# EAGLE design StormBox (EAGLE 5.11)
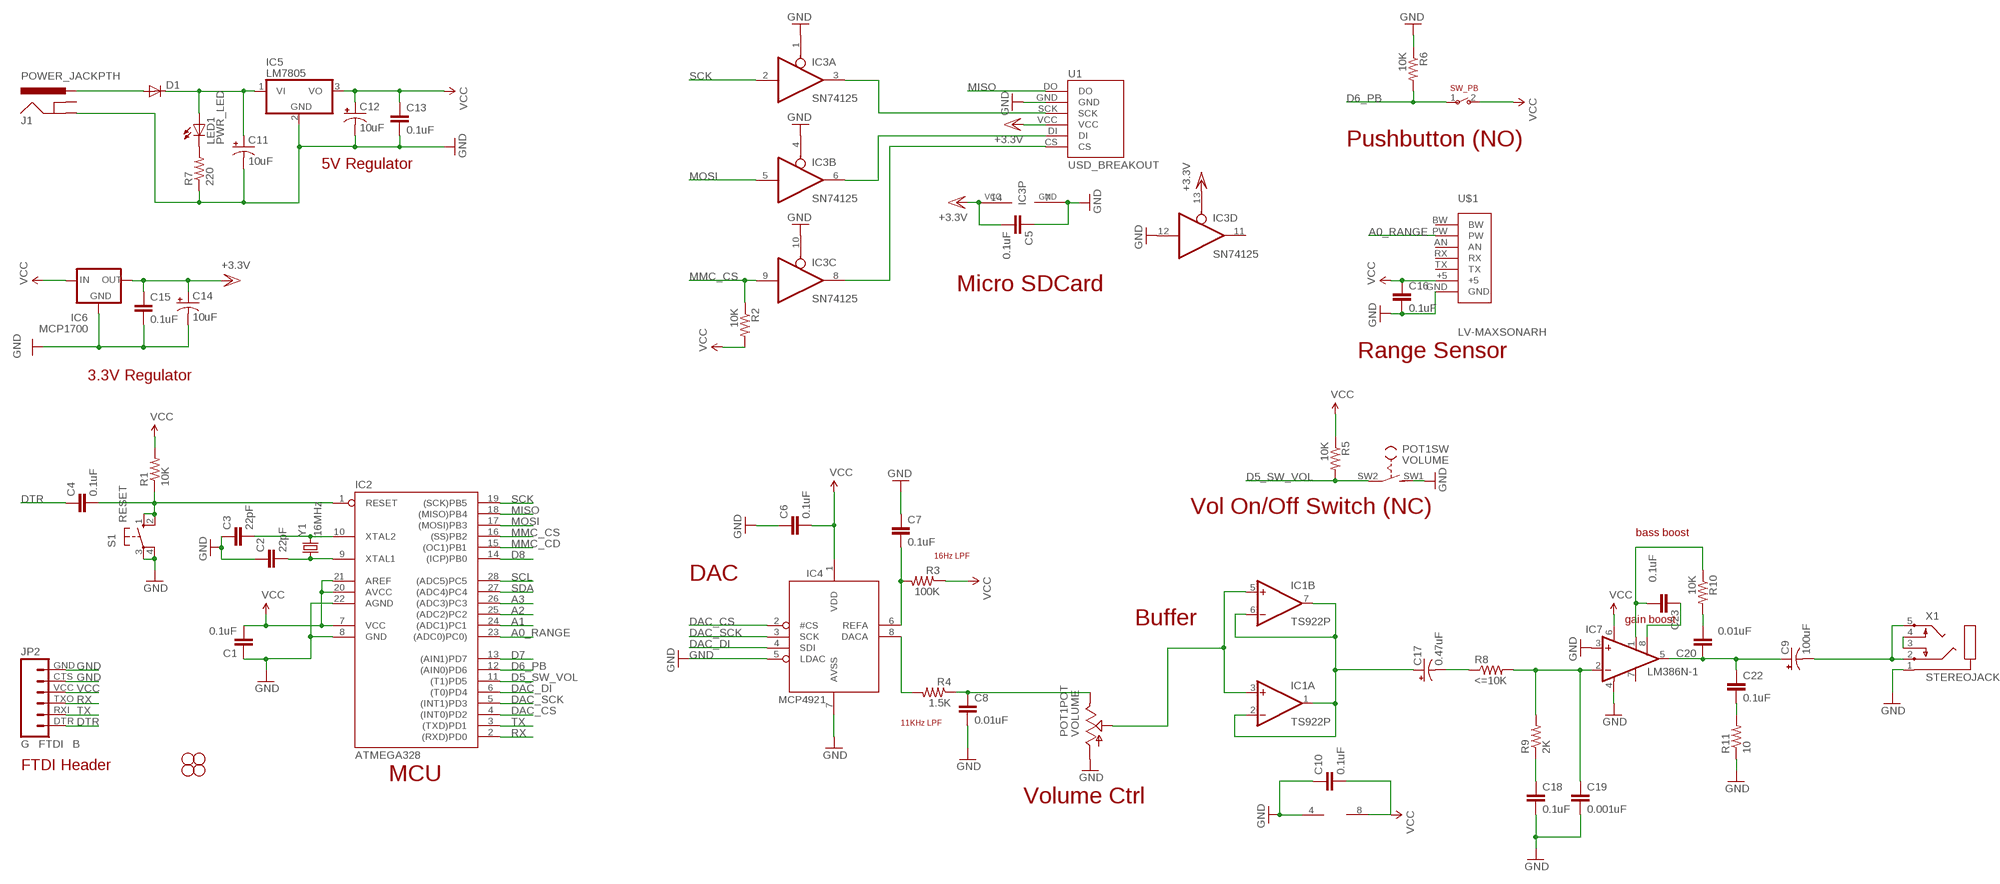
[diagram p0: schematic, sheet 1]

## Parts
C1  0.1uF  CAPPTH  [CAP-PTH-SMALL]
C2  22pF  CAPPTH  [CAP-PTH-SMALL]
C3  22pF  CAPPTH  [CAP-PTH-SMALL]
C4  0.1uF  CAPPTH  [CAP-PTH-SMALL]
C5  0.1uF  CAPPTH  [CAP-PTH-SMALL]
C6  0.1uF  CAPPTH  [CAP-PTH-SMALL]
C7  0.1uF  CAPPTH  [CAP-PTH-SMALL]
C8  0.01uF  CAPPTH  [CAP-PTH-SMALL]
C9  100uF  CAP_POLPTH1  [CPOL-RADIAL-100UF-25V]
C10  0.1uF  CAPPTH  [CAP-PTH-SMALL]
C11  10uF  CAP_POLPTH2  [CPOL-RADIAL-10UF-25V]
C12  10uF  CAP_POLPTH2  [CPOL-RADIAL-10UF-25V]
C13  0.1uF  CAPPTH  [CAP-PTH-SMALL]
C14  10uF  CAP_POLPTH2  [CPOL-RADIAL-10UF-25V]
C15  0.1uF  CAPPTH  [CAP-PTH-SMALL]
C16  0.1uF  CAPPTH  [CAP-PTH-SMALL]
C17  0.47uF  CAP_POLPTH2  [CPOL-RADIAL-10UF-25V]
C18  0.1uF  CAPPTH  [CAP-PTH-SMALL]
C19  0.001uF  CAPPTH  [CAP-PTH-SMALL]
C20  0.01uF  CAPPTH  [CAP-PTH-SMALL]
C22  0.1uF  CAPPTH  [CAP-PTH-SMALL]
C23  0.1uF  CAPPTH  [CAP-PTH-SMALL]
D1  DIODE1N4148  [DIODE-1N4148]
IC1  TS922P  [DIL08]
IC2  ATMEGA328  AT90S4433P  [DIL28-3]
IC3  SN74125  74125N  [DIL14]
IC4  MCP4921  [DIL08]
IC5  LM7805  7805T  [TO220H]
IC6  MCP1700  MCP1700INLINE  [TO92-INLINE]
IC7  LM386N-1  [DIL08]
J1  POWER_JACKPTH  [POWER_JACK_PTH]
JP1  STAND-OFF  [STAND-OFF]
JP2  G FTDI B  FTDI_BASICPTH  [FTDI_BASIC]
JP3  STAND-OFF  [STAND-OFF]
JP4  STAND-OFF  [STAND-OFF]
JP5  STAND-OFF  [STAND-OFF]
LED1  PWR_LED  LED3MM  [LED3MM]
POT1  VOLUME  THUMBPOT  [THUMBWHEEL]
R1  10K  RESISTORPTH-1/4W  [AXIAL-0.4]
R2  10K  RESISTORPTH-1/4W  [AXIAL-0.4]
R3  100K  RESISTORPTH-1/4W  [AXIAL-0.4]
R4  1.5K  RESISTORPTH-1/4W  [AXIAL-0.4]
R5  10K  RESISTORPTH-1/4W  [AXIAL-0.4]
R6  10K  RESISTORPTH-1/4W  [AXIAL-0.4]
R7  220  RESISTORPTH-1/4W  [AXIAL-0.4]
R8  <=10K  RESISTORAXIAL-0.3  [AXIAL-0.3]
R9  2K  RESISTORAXIAL-0.3  [AXIAL-0.3]
R10  10K  RESISTORAXIAL-0.3  [AXIAL-0.3]
R11  10  RESISTORAXIAL-0.3  [AXIAL-0.3]
S1  RESET  10-XX  [B3F-10XX]
SW_PB  BUTTON  SWITCH-SPSTPTH  [1X02_LOCK_LONGPADS]
U1  USD_BREAKOUT  USD_BREAKOUTNOCD  [USD_BREAKOUT]
U$1  LV-MAXSONARH  [LV-MAXSONAR]
X1  STEREOJACK  [STX3100]
Y1  16MHz  CRYSTALHC49US  [HC49US]

## Nets
A0_RANGE: IC2.23((ADC0)PC0)) U$1.PW
A1: IC2.24((ADC1)PC1)
A2: IC2.25((ADC2)PC2)
A3: IC2.26((ADC3)PC3)
D5_SW_VOL: IC2.11((T1)PD5) POT1.SW2(SW:P) R5.P$2
D6_PB: IC2.12((AIN0)PD6) R6.P$2 SW_PB.1
D7: IC2.13((AIN1)PD7)
D8: IC2.14((ICP)PB0)
DAC_CS: IC2.4((INT0)PD2) IC4.2(#CS)
DAC_DI: IC2.6((T0)PD4) IC4.4(SDI)
DAC_SCK: IC2.5((INT1)PD3) IC4.3(SCK)
DTR: C4.1 JP2.DTR
GND [power]: C1.1 C2.1 C3.1 C5.1 C6.1 C7.1 C8.2 C10.1 C11.2(-) C12.2(-) C13.2 C14.2(-) C15.2 C16.2 C18.2 C19.2 IC1.4(P:V-) IC2.8(GND) IC2.22(AGND) IC3.1(A:OE) IC3.4(B:OE) IC3.7(P:GND) IC3.10(C:OE) IC3.12(D:I) IC4.5(LDAC) IC4.7(AVSS) IC5.2(GND) IC6.1(GND) IC7.3(+IN) IC7.4(GND) J1.GND JP2.CTS JP2.GND POT1.1(POT:A) POT1.SW1(SW:S) R6.P$1 R7.P$1 R11.P$1 S1.3(P) S1.4(P1) U1.GND U$1.GND X1.1
LINE_A: IC1.3(A:+IN) IC1.5(B:+IN) POT1.2(POT:S)
MISO: IC2.18((MISO)PB4) U1.DO
MMC_CD: IC2.15((OC1)PB1)
MMC_CS: IC2.16((SS)PB2) IC3.9(C:I) R2.P$1
MOSI: IC2.17((MOSI)PB3) IC3.5(B:I)
N$1: IC3.8(C:O) U1.CS
N$2: IC3.6(B:O) U1.DI
N$3: C4.2 IC2.1(RESET) R1.P$1 S1.1(S) S1.2(S1)
N$4: C17.2(-) R8.P$1
N$5: IC3.3(A:O) U1.SCK
N$6: C8.1 POT1.3(POT:E) R4.P$1
N$7: IC4.8(DACA) R4.P$2
N$8: C17.1(+) IC1.1(A:OUT) IC1.2(A:-IN) IC1.6(B:-IN) IC1.7(B:OUT)
N$9 [power]: C11.1(+) D1.C IC5.1(VI) LED1.A
N$10: LED1.K(C) R7.P$2
N$11 [power]: D1.A J1.PWR
N$12: X1.3 X1.4
N$13: C9.2(-) X1.2 X1.5
N$14: C19.1 IC7.2(-IN) R8.P$2 R9.P$2
N$15: C18.1 R9.P$1
N$16: C23.1 IC7.8(GAIN)
N$17: C9.1(+) C20.1 C22.1 IC7.5(OUT)
N$18: C20.2 R10.P$2
N$19: C7.2 IC4.6(REFA) R3.P$2
N$20: C23.2 IC7.1(GAIN) R10.P$1
N$21: C22.2 R11.P$2
RX: IC2.2((RXD)PD0) JP2.TXO
SCK: IC2.19((SCK)PB5) IC3.2(A:I)
SCL: IC2.28((ADC5)PC5)
SDA: IC2.27((ADC4)PC4)
TX: IC2.3((TXD)PD1) JP2.RXI
VCC [power]: C1.2 C6.2 C10.2 C12.1(+) C13.1 C16.1 IC1.8(P:V+) IC2.7(VCC) IC2.20(AVCC) IC2.21(AREF) IC4.1(VDD) IC5.3(VO) IC6.2(IN) IC7.6(VS) JP2.VCC R1.P$2 R2.P$2 R3.P$1 R5.P$1 SW_PB.2 U$1.+5
VCC/2 [power]: C5.2 C14.1(+) C15.1 IC3.13(D:OE) IC3.14(P:VCC) IC6.3(OUT) U1.VCC ; supply symbol labelled +3.3V
XTAL1: C2.2 IC2.9(XTAL1) Y1.1
XTAL2: C3.2 IC2.10(XTAL2) Y1.2
Unconnected: IC3.11(D:O) IC7.7(BYPASS) J1.GNDBREAK U$1.AN U$1.BW U$1.RX U$1.TX

## Notes on the sheet
- Pushbutton (NO)
- 5V Regulator
- Micro SDCard
- Range Sensor
- 3.3V Regulator
- Vol On/Off Switch (NC)
- bass boost
- 16Hz LPF
- DAC
- Buffer | gain boost
- 11KHz LPF
- FTDI Header
- MCU
- Volume Ctrl

## Library data of the parts
C1-C8 C10 C13 C15 C16 C18-C20 C22 C23 = SparkFun:CAP: Capacitor Standard 0603 ceramic capacitor, and 0.1" leaded capacitor.
C9 C11 C12 C14 C17 = SparkFun:CAP_POL: Capacitor Polarized These are standard SMD and PTH capacitors. Normally 10uF, 47uF, and 100uF in electrolytic and tantalum varieties. Always verify the external diameter of the through hole cap, it varies with capacity, voltage, and manufacturer. The EIA devices should be standard.
D1 = SparkFun:DIODE: Diode These are standard reverse protection diodes and small signal diodes. SMA package can handle up to about 1A. SOD-323 can handle about 200mA. What the SOD-323 package when ordering, there are some mfgs out there that are 5-pin packages.
IC1 = Dek:TS922: OP AMP
IC2 = atmel:AT90S4433: MICROCONTROLLER 4 Kbytes FLASH 128 bytes SRAM 256 bytes EEPROM UART 6-channel 10 bit ADC; OC_FARNELL: unknown; OC_NEWARK: unknown
IC3 = adafruit:74*125: Quad bus BUFFER, 3-state
IC4 = adafruit:MCP4921
IC5 = linear:78*: Positive VOLTAGE REGULATOR Source: http://cache.national.com/ds/LM/LM78L05.pdf http://www.fairchildsemi.com/ds/LM/LM7805.pdf
IC6 = adafruit:MCP1700: VOLTAGE REGULATOR
IC7 = Dek:LM386?-*: Low Voltage Audio Power Amplifier Source: http://cache.national.com/ds/LM/LM386.pdf
J1 = SparkFun:POWER_JACK: Power Jack This is the standard 5.5mm barrel jack for power. The PTH is the most common, proven, reliable, footprint. All others are experimental. The Slot footprint only works if the mill layer is transmitted to the PCB fab house so be warned. Spark Fun Electronics SKU : PRT-00119. Mating wall wart : TOL-00298 (and others)
JP1 JP3-JP5 = SparkFun:STAND-OFF: Stand Off This is the mechanical footprint for a #4 phillips button head screw. Use the keepout ring to avoid running the screw head into surrounding components. SKU : PRT-00447
JP2 = SparkFun:FTDI_BASIC: FTDI Basic: 3.3V and 5V
LED1 = SparkFun:LED: LEDs Standard schematic elements and footprints for 5mm, 3mm, 1206, and 0603 sized LEDs. 5mm - Spark Fun Electronics SKU : COM-00529 (and others)
POT1 = adafruit:THUMBPOT: Thumbwheel pot with switch Available in horizontal (Alpha RV121SF) or vertical (Xicon 311-1701)
R1-R11 = SparkFun:RESISTOR: Resistor Basic schematic elements and footprints for 0603, 1206, and PTH resistors.
S1 = switch-omron:10-XX: OMRON SWITCH; MPN: B3F-1000; OC_FARNELL: 176432; OC_NEWARK: 36M3542
SW_PB = Dek:SWITCH-SPST
U1 = Dek:USD_BREAKOUT
U$1 = Dek:LV-MAXSONAR
X1 = adafruit:STEREOJACK: MIC/HEADPHONE JACK Stereo jack with two switches. Kycon STX3100, CUI SJ1-3555NG and/or 4UCon 05544
Y1 = SparkFun:CRYSTAL: Crystals Various standard crystals. Proven footprints. Spark Fun Electronics SKU : COM-00534

## Board
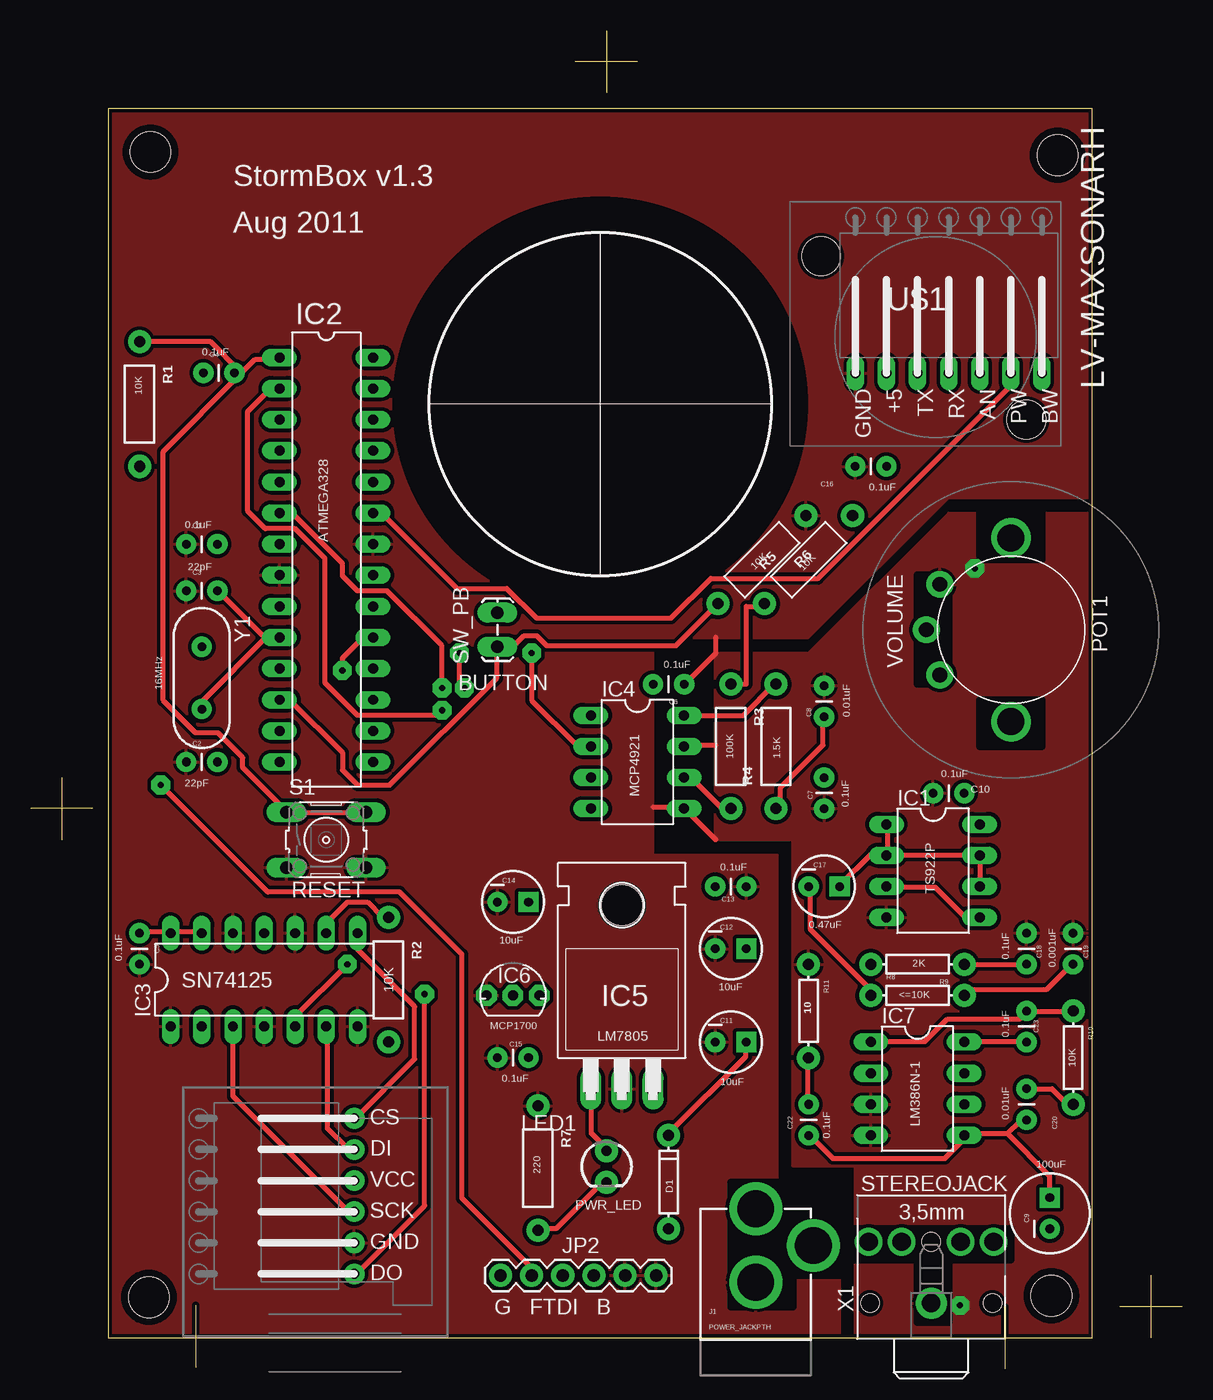
[diagram p1: board, top side]
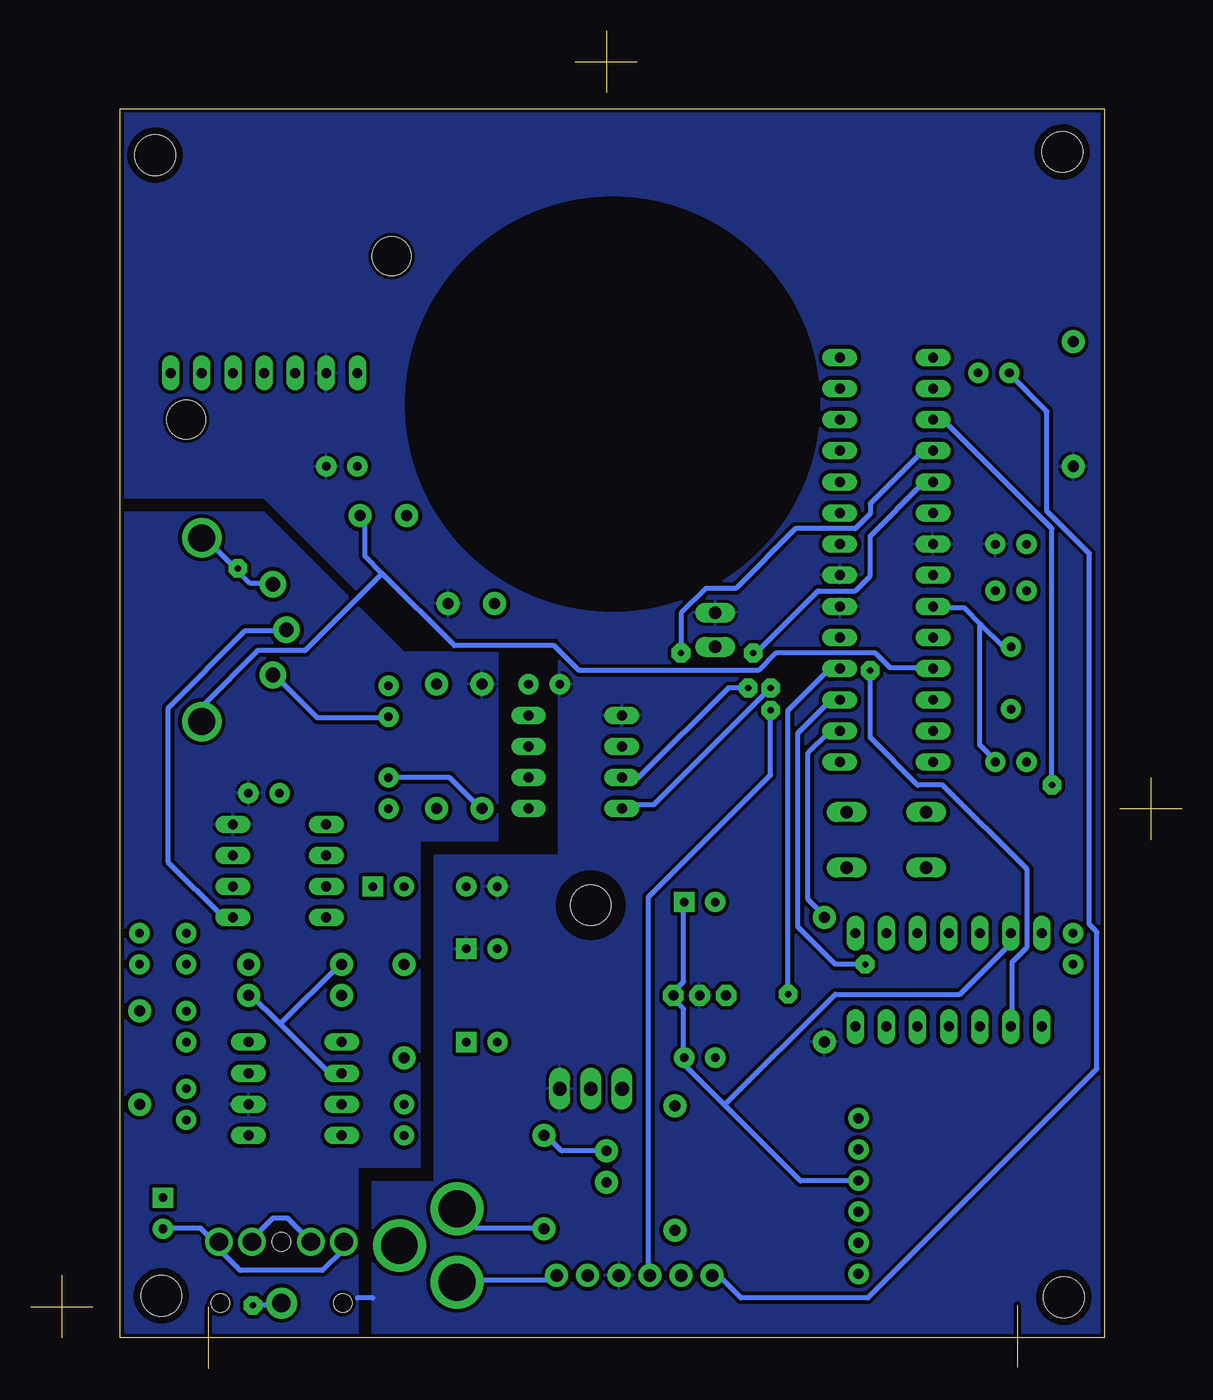
[diagram p2: board, bottom side, seen from below]

Size 93.98 x 109.22 mm. Coordinates in mm from the lower left corner, seen from the top.
Outline: 13.46,5.21 13.46,0.13
Outline: 79.5,5.08 79.5,0
Outline: 49.53,106.68 44.45,106.68
Outline: 46.99,109.22 46.99,104.14
Outline: 5.08,45.72 0,45.72
Outline: 2.54,48.26 2.54,43.18
Outline: 93.98,5.08 88.9,5.08
Outline: 91.44,7.62 91.44,2.54
Outline: 6.35,2.54 86.66,2.54 86.66,102.86 6.35,102.86 6.35,2.54
Copper layers (1*16): Top 0.035mm / dielectric 1.5mm / Bottom 0.035mm
Design rules "Dek": minimum track width 16mil, minimum drill 20mil, track to track 12mil, track to pad 12mil, pad to pad 12mil, via to via 12mil, smd to smd 0mil, copper to edge 10mil, drill to drill 12mil, minimum pad ring 12mil, minimum via ring 20mil, stop-mask expansion 4mil, vias tented up to drill 25mil, thermal gap 10mil
tRestrict: area 30,62.2 to 63,95.3; area 77.5,66 to 82.5,69.9; area 72.4,55.9 to 74.9,64.8; area 77.5,50.8 to 82.5,54.6; area 67.3,8.9 to 80,11.4; area 72.4,3.8 to 74.9,11.4; area 57.1,7.6 to 66,12.7; area 57.1,5.1 to 62.2,15.2
bRestrict: area 30,62.2 to 63,95.3

### Footprints (pad centres in the part's own frame; a part is rotated, then mirrored left to right if it is on the bottom)
CAP-PTH-SMALL = drill 0.7 pad 1.651 round: 1 0,0; 2 2.54,0
CPOL-RADIAL-100UF-25V = drill 0.7 pad 1.651 square: 1 1.27,0 | drill 0.7 pad 1.651 round: 2 -1.27,0
CPOL-RADIAL-10UF-25V = drill 0.7 pad 1.651 square: 1 1.27,0 | drill 0.7 pad 1.651 round: 2 -1.27,0
DIODE-1N4148 = drill 0.9 pad 1.88 round: A -3.81,0; C 3.81,0
DIL08 = drill 0.813 pad 1.27 long: 1 -3.81,-3.81; 2 -1.27,-3.81; 3 1.27,-3.81; 4 3.81,-3.81; 5 3.81,3.81; 6 1.27,3.81; 7 -1.27,3.81; 8 -3.81,3.81
DIL28-3 = drill 0.813 long: 1 -16.51,-3.81; 2 -13.97,-3.81; 3 -11.43,-3.81; 4 -8.89,-3.81; 5 -6.35,-3.81; 6 -3.81,-3.81; 7 -1.27,-3.81; 8 1.27,-3.81; 9 3.81,-3.81; 10 6.35,-3.81; 11 8.89,-3.81; 12 11.43,-3.81; 13 13.97,-3.81; 14 16.51,-3.81; 15 16.51,3.81; 16 13.97,3.81; 17 11.43,3.81; 18 8.89,3.81; 19 6.35,3.81; 20 3.81,3.81; 21 1.27,3.81; 22 -1.27,3.81; 23 -3.81,3.81; 24 -6.35,3.81; 25 -8.89,3.81; 26 -11.43,3.81; 27 -13.97,3.81; 28 -16.51,3.81
DIL14 = drill 0.813 long: 1 -7.62,-3.81; 2 -5.08,-3.81; 3 -2.54,-3.81; 4 0,-3.81; 5 2.54,-3.81; 6 5.08,-3.81; 7 7.62,-3.81; 8 7.62,3.81; 9 5.08,3.81; 10 2.54,3.81; 11 0,3.81; 12 -2.54,3.81; 13 -5.08,3.81; 14 -7.62,3.81
DIL08' = drill 0.813 long: 1 -3.81,-3.81; 2 -1.27,-3.81; 3 1.27,-3.81; 4 3.81,-3.81; 5 3.81,3.81; 6 1.27,3.81; 7 -1.27,3.81; 8 -3.81,3.81
TO220H = drill 1.118 long: 1 -2.54,-10.16; 2 0,-10.16; 3 2.54,-10.16 | hole 3.302: 0,4.826
TO92-INLINE = drill 0.813 pad 1.676 octagon: 1 -2.159,0; 2 0,0; 3 2.159,0
POWER_JACK_PTH = drill 2.997 pad 4.318 round: GND 0,7.7; GNDBREAK 4.7,10.7; PWR 0,13.7
STAND-OFF = hole 3.302: 0,0
FTDI_BASIC = drill 1.016 pad 1.88 round: CTS 10.16,0; DTR 0,0; GND 12.7,0; RXI 2.54,0; TXO 5.08,0; VCC 7.62,0
LED3MM = drill 0.813 pad 1.88 round: A -1.27,0; K 1.27,0
THUMBWHEEL = drill 1.2 pad 2.184 round: 1 -3.7,-5.8; 2 0,-6.9; 3 3.7,-5.8 | drill 2.2 round: SW1 -7.5,0; SW2 7.5,0
AXIAL-0.4 = drill 0.9 pad 1.88 round: P$1 -5.08,0; P$2 5.08,0
AXIAL-0.3 = drill 0.9 pad 1.88 round: P$1 -3.81,0; P$2 3.81,0
B3F-10XX = drill 1.016 long: 1 -3.251,2.261; 2 3.251,2.261; 3 -3.251,-2.261; 4 3.251,-2.261
1X02_LOCK_LONGPADS = drill 1.016 long: 1 -0.127,0; 2 2.667,0
USD_BREAKOUT = drill 0.8 pad 1.676 round: CS 7.62,2.54; DI 7.62,5.08; DO 7.62,15.24; GND 7.62,12.7; SCK 7.62,10.16; VCC 7.62,7.62
LV-MAXSONAR = drill 0.8 long: +5 -13.97,13.97; AN -13.97,6.35; BW -13.97,1.27; GND -13.97,16.51; PW -13.97,3.81; RX -13.97,8.89; TX -13.97,11.43 | hole 3.15: -17.78,2.54; -4.445,19.304
STX3100 = drill 1.5 pad 2.54 round: 1 2.7,-0.1 | drill 1.5 round: 2 7.7,5; 3 7.7,2.3; 4 7.7,-2.5; 5 7.7,-5.2 | hole 1.5: 2.7,4.9; 2.7,-5.1; 7.7,-0.1
HC49US = drill 0.7 pad 1.651 round: 1 -2.54,0; 2 2.54,0

### Placement (x,y rotation side)
C1  12.7,67.31 0 top
C2  12.7,49.53 0 top
C3  12.7,63.5 0 top
C4  14.1,81.28 0 top
C5  8.89,33.02 90 top
C6  53.34,55.88 180 top
C7  64.77,45.72 90 top
C8  64.77,53.21 90 top
C9  83.18,12.7 90 top
C10  73.66,46.99 0 top
C11  57.15,26.67 0 top
C12  57.15,34.29 0 top
C13  55.88,39.37 0 top
C14  39.37,38.1 0 top
C15  40.64,25.4 180 top
C16  69.85,73.66 180 top
C17  64.77,39.37 0 top
C18  81.28,33.02 90 top
C19  85.09,33.02 90 top
C20  81.28,20.32 90 top
C22  63.5,19.05 90 top
C23  81.28,26.67 90 top
D1  52.07,15.24 90 top
IC1  73.66,40.64 270 top
IC2  24.13,66.04 270 top
IC3  19.05,31.75 0 top
IC4  MCP4921  [DIL08']  49.53,49.53 270 top
IC5  48.26,33.02 0 top
IC6  39.37,30.48 0 top
IC7  72.39,22.86 270 top
J1  59.18,-0.63 0 top
JP1  9.65,5.84 0 top
JP2  38.35,7.62 0 top
JP3  9.78,99.31 0 top
JP4  83.31,5.97 0 top
JP5  83.82,99.06 0 top
LED1  46.99,16.51 270 top
POT1  80.01,60.32 270 top
R1  8.89,78.74 270 top
R2  29.21,31.75 270 top
R3  57.15,50.8 270 top
R4  60.83,50.8 90 top
R5  63.5,66.04 45 top
R6  59.69,66.04 225 top
R7  41.4,16.38 270 top
R8  72.39,30.48 0 top
R9  72.39,33.02 180 top
R10  85.09,25.4 270 top
R11  63.5,29.21 270 top
S1  24.13,43.18 0 top
SW_PB  38.1,59.05 90 top
U1  34.04,22.99 180 top
U$1  83.82,95.25 90 top
X1  73.41,2.67 90 top
Y1  13.97,56.39 270 top

### Tracks (layer width: path | path; a pad name or v marks a point on that pad's centre or on a via)
A0_RANGE
  Top 0.406: U$1.PW 79.91,81.18 79.91,80.16 64.26,64.52 55.52,64.52 52.27,61.27 41.3,61.27 38.86,63.7 34.8,63.7 28.7,69.8 28.09,69.8 IC2.23
D5_SW_VOL
  Bottom 0.406: 65.28,64.92 66.7,66.34 66.7,69.39 66.9,69.6 R5.P$2 | 65.28,64.92 59.38,59.03 51.26,59.03 49.23,57 34.59,57 33.17,58.42 25.04,58.42 23.83,57.2 20.37,57.2 IC2.11 | 65.28,64.92 71.58,58.62 75.44,58.62 79.91,54.15 79.91,52.93 POT1.SW2
D6_PB
  Top 0.406: IC2.12 20.37,54.56 21.18,54.56 25.45,50.29 25.45,48.87 26.67,47.65 29.31,47.65 38.05,56.39 38.05,58.83 SW_PB.1 38.25,59.03 39.47,59.03 40.28,59.84 41.3,59.84 42.11,59.03 52.68,59.03 R6.P$2
DAC_CS  (via drill 0.51)
  Top 0.406: v40.89,58.42 40.89,54.56 44.55,50.9 45.57,50.9 IC4.2
  Bottom 0.406: v40.89,58.42 40.89,61.67 38.86,63.7 36.42,63.7 31.55,68.58 26.67,68.58 25.45,69.8 25.45,70.61 21.18,74.88 20.37,74.88 IC2.4
DAC_DI  (via drill 0.51)
  Top 0.406: v33.58,55.57 33.58,59.03 29.11,63.5 26.67,63.5 25.45,64.72 25.45,65.73 21.39,69.8 20.37,69.8 IC2.6
  Bottom 0.406: v33.58,55.57 43.13,46.02 45.36,46.02 45.57,45.82 IC4.4
DAC_SCK  (via drill 0.51)
  Top 0.406: v35,58.42 35,55.98 v35.41,55.57
  Bottom 0.406: v35,58.42 34.8,58.42 29.72,63.5 26.67,63.5 25.45,64.72 25.45,67.97 21.18,72.24 20.37,72.24 IC2.5 | v35.41,55.57 37.03,55.57 44.35,48.26 IC4.3
DTR
  Bottom 0.406: C4.1 14.07,81.18 11.02,78.13 11.02,70 7.57,66.55 7.57,36.27 6.96,35.66 6.96,24.49 25.65,5.79 36.02,5.79 37.85,7.62 JP2.DTR
GND  (via drill 0.51)
  Top 0.406: 50.8,45.82 53.29,45.82 IC4.5 53.49,45.62 55.93,43.18 | 55.93,50.9 53.49,50.9 IC4.7 | 55.93,58.42 53.49,55.98 C6.1 | 55.93,58.42 55.88,58.42 | 55.93,58.42 55.93,59.69
  Bottom 0.406: 77.16,65.23 79.91,67.97 POT1.SW1 | 77.16,65.23 76.05,64.11 74.22,64.11 POT1.1 | v75.84,5.18 73.61,5.18 X1.1 | 77.16,65.23 v77.06,65.33 | JP2.GND 51.46,7.21 59.18,7.21 J1.GND
  pour Top (isolate 0.305): 67.31,1.27 67.31,16.51 62.23,16.51 62.23,43.18 55.88,43.18 55.88,58.42 63.5,58.42 74.93,69.85 88.9,69.85 88.9,1.27
  pour Top (isolate 0.305): 66.04,1.27 66.04,15.24 60.96,15.24 60.96,41.91 50.8,41.91 50.8,59.69 63.5,59.69 74.93,71.12 88.9,71.12 88.9,104.14 5.08,104.14 5.08,1.27
LINE_A
  Top 0.406: IC1.3 69.95,39.32 73.81,39.32 76.25,36.88 77.47,36.88 IC1.5
  Bottom 0.406: POT1.2 73.2,60.25 76.45,60.25 82.75,53.95 82.75,41.35 78.28,36.88 77.47,36.88 IC1.5
MISO  (via drill 0.51)
  Top 0.406: v32.16,30.58 32.16,13.31 26.47,7.62 U1.DO
  Bottom 0.406: v32.16,30.58 32.16,53.75 28.91,57 28.09,57 IC2.18
MMC_CS
  Top 0.406: IC3.9 24.23,35.66 24.23,36.47 25.86,38.1 27.48,38.1 28.7,36.88 29.11,36.88 R2.P$1
  Bottom 0.406: IC2.16 28.09,51.92 28.91,51.92 30.53,50.29 30.53,38.3 29.11,36.88 R2.P$1
MOSI  (via drill 0.51)
  Top 0.406: IC3.5 21.59,28.75 v25.86,33.02
  Bottom 0.406: v25.86,33.02 28.3,33.02 31.34,36.07 31.34,51.92 28.7,54.56 28.09,54.56 IC2.17
N$1
  Top 0.406: IC3.8 26.67,34.24 31.34,29.57 31.34,25.3 26.47,20.42 U1.CS
N$2
  Top 0.406: IC3.6 24.23,27.94 24.23,19.61 25.86,17.98 26.26,17.98 U1.DI
N$3
  Top 0.406: S1.2 27.28,45.41 20.98,45.41 S1.1 20.78,45.62 17.32,49.07 17.32,49.89 15.29,51.92 13.46,51.92 10.82,54.56 10.82,74.88 17.12,81.18 C4.2 | 17.12,81.38 16.71,81.38 C4.2 | 17.12,81.38 17.32,81.38 18.34,82.4 20.17,82.4 IC2.1 | 17.12,81.38 14.68,83.82 R1.P$1 | C4.2 17.12,81.38
N$4
  Top 0.406: C17.2 63.65,39.32 63.65,35.87 68.53,30.99 68.53,30.58 R8.P$1
N$5
  Top 0.406: IC3.3 16.51,22.25 25.86,12.9 26.26,12.9 U1.SCK
N$6
  Top 0.406: C8.1 64.67,53.14 64.67,50.9 61.21,47.45 61.21,46.02 61.01,45.82 R4.P$1
  Bottom 0.406: POT1.3 74.02,56.59 70.56,53.14 64.87,53.14 C8.1
N$7
  Top 0.406: IC4.8 58.17,53.34 60.81,55.98 R4.P$2
N$8
  Top 0.406: IC1.6 IC1.7 77.47,41.96 70.16,41.96 IC1.2 | IC1.2 69.95,41.96 69.95,44.4 IC1.1 | C17.1 66.09,39.52 68.53,41.96 69.75,41.96 IC1.2
N$9
  Top 0.406: LED1.A 46.99,17.98 45.77,19.2 45.77,22.86 IC5.1 | C11.1 58.37,26.52 58.37,25.5 52.07,19.2 D1.C
  Bottom 0.406: LED1.A 50.65,17.78 52.07,19.2 D1.C
N$10
  Top 0.406: R7.P$2 41.5,11.48 42.93,11.48 46.58,15.14 46.99,15.14 LED1.K
N$11
  Bottom 0.406: D1.A 52.07,11.48 57.56,11.48 59.18,13.11 J1.PWR
N$12
  Bottom 0.406: X1.3 71.17,10.46 73,12.29 74.22,12.29 76.05,10.46 X1.4
N$13
  Bottom 0.406: C9.2 83.16,11.48 80.11,11.48 79.1,10.46 78.69,10.46 X1.5 79.3,10.46 76.86,8.03 70.16,8.03 68.53,9.65 68.53,10.26 X1.2
N$14
  Top 0.406: C19.1 84.99,33.02 82.96,30.99 76.66,30.99 76.25,30.58 R8.P$2
  Bottom 0.406: 73.61,28.14 76.05,30.58 R8.P$2 | 73.61,28.14 69.75,24.28 68.73,24.28 IC7.2 | 73.61,28.14 68.73,33.02 R9.P$2
N$15
  Top 0.406: R9.P$1 C18.1
N$16
  Top 0.406: IC7.8 76.25,26.72 81.13,26.72 C23.1
N$17
  Top 0.406: 76.66,19.2 79.7,19.2 | 76.66,19.2 76.25,19.2 IC7.5 76.66,19.2 | 79.7,19.2 80.72,20.22 81.13,20.22 C20.1 | 76.66,19.2 74.62,17.17 65.48,17.17 63.65,19 C22.1 | 79.7,19.2 83.16,15.75 83.16,14.12 C9.1
N$18
  Top 0.406: C20.2 83.36,22.86 84.58,21.64 84.99,21.64 R10.P$2
N$19
  Top 0.406: IC4.6 53.9,48.26 56.34,45.82 57.15,45.82 R3.P$2
  Bottom 0.406: C7.2 59.79,48.26 57.15,45.62 R3.P$2
N$20
  Top 0.406: 81.33,29.16 80.72,28.55 74.83,28.55 73,26.72 68.73,26.72 IC7.1 | 81.33,29.16 84.99,29.16 R10.P$1 | 81.33,29.16 C23.2
N$21
  Top 0.406: C22.2 63.45,21.64 63.45,25.3 R11.P$2
RX  (via drill 0.51)
  Top 0.406: v33.58,53.75 33.17,53.34 26.67,53.34 24.03,55.98 24.03,66.14 21.59,68.58 19.15,68.58 17.73,70 17.73,78.13 19.56,79.96 20.17,79.96 IC2.2
  Bottom 0.406: v33.58,53.75 33.58,48.46 43.54,38.51 43.54,7.62 JP2.TXO
SCK  (via drill 0.51)
  Top 0.406: v25.45,57 25.45,58.01 27.08,59.64 27.89,59.64 IC2.19
  Bottom 0.406: v25.45,57 25.45,51.51 21.59,47.65 19.56,47.65 12.65,40.74 12.65,34.44 13.87,33.22 13.87,27.94 IC3.2
TX  (via drill 0.51)
  Top 0.406: v10.62,47.65 19.36,38.91 30.12,38.91 35.2,33.83 35.2,13.92 40.89,8.23 JP2.RXI
  Bottom 0.406: v10.62,47.65 10.62,68.58 19.36,77.32 20.17,77.32 IC2.3
VCC
  Top 0.406: R3.P$1 58.42,55.88 58.42,62.23 59.91,62.23 R5.P$1
  Bottom 0.406: 66.04,5.79 67.31,5.79
  pour Bottom (isolate 0.305): 67.31,1.27 67.31,16.51 62.23,16.51 62.23,43.18 55.88,43.18 55.88,58.42 63.5,58.42 74.93,69.85 87.63,69.85 87.63,1.27
  pour Bottom (isolate 0.305): 66.04,1.27 66.04,15.24 60.96,15.24 60.96,41.91 50.8,41.91 50.8,59.69 63.5,59.69 74.93,71.12 87.63,71.12 87.63,104.14 5.08,104.14 5.08,1.27
VCC/2
  Top 0.406: 11.43,35.66 13.87,35.66 IC3.13 | 11.43,35.66 8.99,35.66 C5.2 | 11.43,35.66 IC3.14
  Bottom 0.406: C14.1 40.69,38.1 40.69,31.6 41.71,30.58 IC6.3 41.71,30.38 40.69,29.36 40.69,25.5 C15.1 40.49,25.3 40.49,24.69 37.34,21.54 | 37.34,21.54 31.14,15.34 26.47,15.34 U1.VCC | IC3.13 14.07,35.46 14.07,34.65 18.14,30.58 28.3,30.58 37.34,21.54
XTAL1
  Bottom 0.406: 16.41,60.76 14.68,59.03 14.07,59.03 Y1.1 | 16.41,60.76 17.73,62.08 20.17,62.08 IC2.9 | C2.2 15.29,49.68 16.51,50.9 16.51,60.66 16.41,60.76
XTAL2
  Top 0.406: 19.36,59.84 18.95,59.84 15.29,63.5 C3.2 | 19.36,59.84 20.17,59.84 IC2.10 19.36,59.84 | 19.36,59.84 14.07,54.56 14.07,53.95 Y1.2

### Text on the board
tPlace: StormBox v1.3 | Aug 2011